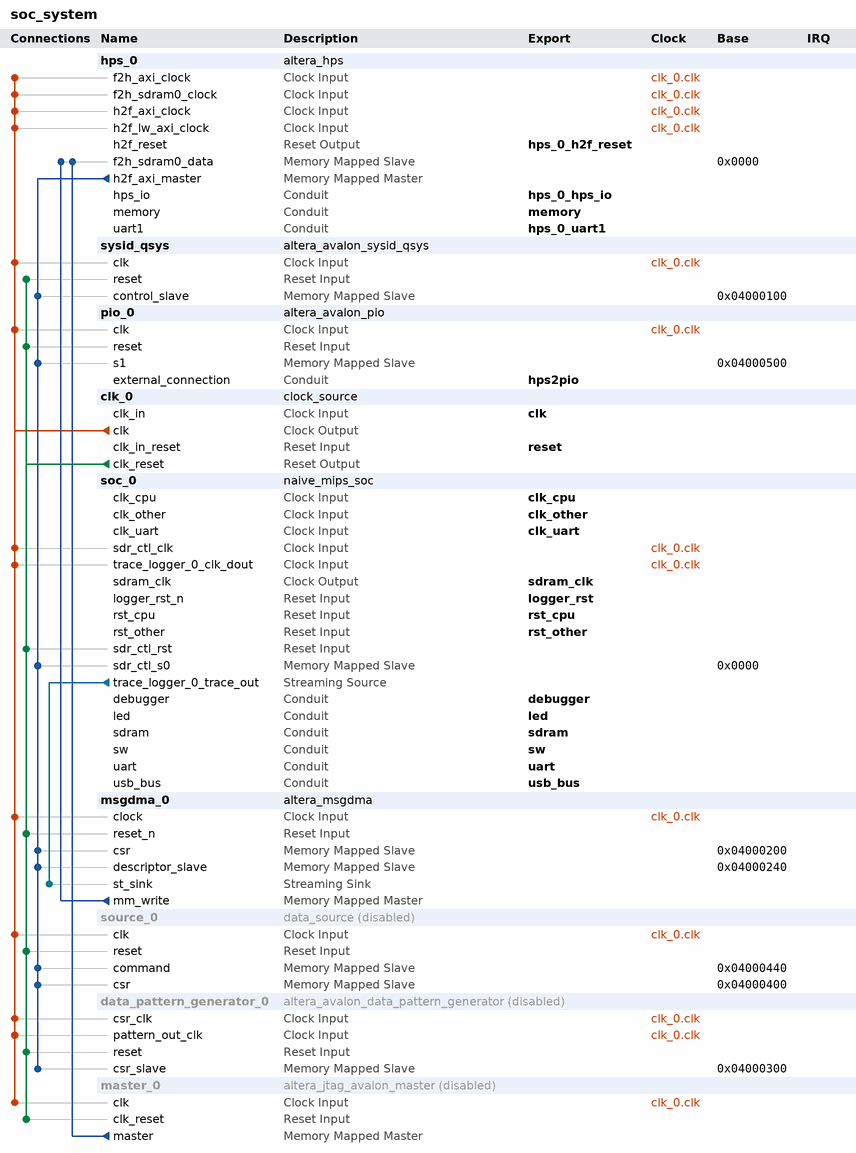
[diagram p0: system contents]
# Platform Designer (Qsys) system soc_system, Cyclone V 5CSEMA5F31C6
# Parameters at their usual value, and those the tool derives, are not listed.
package require -exact qsys 15.1
create_system soc_system
set_project_property DEVICE_FAMILY {Cyclone V}
set_project_property DEVICE 5CSEMA5F31C6

add_instance hps_0 altera_hps 15.1
set_instance_parameter_value hps_0 EMAC1_Mode RGMII
set_instance_parameter_value hps_0 EMAC1_PinMuxing {HPS I/O Set 0}
set_instance_parameter_value hps_0 F2SCLK_COLDRST_Enable false
set_instance_parameter_value hps_0 F2SCLK_DBGRST_Enable false
set_instance_parameter_value hps_0 F2SCLK_WARMRST_Enable false
set_instance_parameter_value hps_0 F2SDRAM_Type {Avalon-MM Bidirectional}
set_instance_parameter_value hps_0 F2SDRAM_Width 256
set_instance_parameter_value hps_0 F2SINTERRUPT_Enable false
set_instance_parameter_value hps_0 F2S_Width 2
set_instance_parameter_value hps_0 FPGA_PERIPHERAL_OUTPUT_CLOCK_FREQ_EMAC0_GTX_CLK 100
set_instance_parameter_value hps_0 FPGA_PERIPHERAL_OUTPUT_CLOCK_FREQ_EMAC0_MD_CLK 100.0
set_instance_parameter_value hps_0 FPGA_PERIPHERAL_OUTPUT_CLOCK_FREQ_EMAC1_GTX_CLK 100
set_instance_parameter_value hps_0 FPGA_PERIPHERAL_OUTPUT_CLOCK_FREQ_EMAC1_MD_CLK 100.0
set_instance_parameter_value hps_0 HPS_PROTOCOL DDR3
set_instance_parameter_value hps_0 I2C0_Mode I2C
set_instance_parameter_value hps_0 I2C0_PinMuxing {HPS I/O Set 0}
set_instance_parameter_value hps_0 I2C1_Mode I2C
set_instance_parameter_value hps_0 I2C1_PinMuxing {HPS I/O Set 0}
set_instance_parameter_value hps_0 LWH2F_Enable true
set_instance_parameter_value hps_0 MEM_BANKADDR_WIDTH 3
set_instance_parameter_value hps_0 MEM_CLK_FREQ 400.0
set_instance_parameter_value hps_0 MEM_COL_ADDR_WIDTH 10
set_instance_parameter_value hps_0 MEM_DQ_WIDTH 32
set_instance_parameter_value hps_0 MEM_DRV_STR RZQ/6
set_instance_parameter_value hps_0 MEM_ROW_ADDR_WIDTH 15
set_instance_parameter_value hps_0 MEM_RTT_NOM RZQ/6
set_instance_parameter_value hps_0 MEM_RTT_WR {Dynamic ODT off}
set_instance_parameter_value hps_0 MEM_TCL 7
set_instance_parameter_value hps_0 MEM_TFAW_NS 45.0
set_instance_parameter_value hps_0 MEM_TRAS_NS 36.0
set_instance_parameter_value hps_0 MEM_TRCD_NS 13.125
set_instance_parameter_value hps_0 MEM_TRFC_NS 300.0
set_instance_parameter_value hps_0 MEM_TRP_NS 13.125
set_instance_parameter_value hps_0 MEM_VENDOR Micron
set_instance_parameter_value hps_0 MEM_WTCL 7
set_instance_parameter_value hps_0 QSPI_Mode {1 SS}
set_instance_parameter_value hps_0 QSPI_PinMuxing {HPS I/O Set 0}
set_instance_parameter_value hps_0 REF_CLK_FREQ 25.0
set_instance_parameter_value hps_0 S2FCLK_USER2CLK 1
set_instance_parameter_value hps_0 S2F_Width 1
set_instance_parameter_value hps_0 SDIO_Mode {4-bit Data}
set_instance_parameter_value hps_0 SDIO_PinMuxing {HPS I/O Set 0}
set_instance_parameter_value hps_0 SPIM1_Mode {Single Slave Select}
set_instance_parameter_value hps_0 SPIM1_PinMuxing {HPS I/O Set 0}
set_instance_parameter_value hps_0 STM_Enable false
set_instance_parameter_value hps_0 TIMING_BOARD_AC_SKEW 0.02
set_instance_parameter_value hps_0 TIMING_BOARD_AC_TO_CK_SKEW 0.01
set_instance_parameter_value hps_0 TIMING_BOARD_DQ_TO_DQS_SKEW 0.05
set_instance_parameter_value hps_0 TIMING_BOARD_MAX_CK_DELAY 0.03
set_instance_parameter_value hps_0 TIMING_BOARD_MAX_DQS_DELAY 0.02
set_instance_parameter_value hps_0 TIMING_BOARD_SKEW_BETWEEN_DQS 0.06
set_instance_parameter_value hps_0 TIMING_BOARD_SKEW_CKDQS_DIMM_MAX 0.12
set_instance_parameter_value hps_0 TIMING_BOARD_SKEW_CKDQS_DIMM_MIN 0.06
set_instance_parameter_value hps_0 TIMING_BOARD_SKEW_WITHIN_DQS 0.01
set_instance_parameter_value hps_0 TIMING_TDH 65
set_instance_parameter_value hps_0 TIMING_TDQSCK 255
set_instance_parameter_value hps_0 TIMING_TDQSQ 125
set_instance_parameter_value hps_0 TIMING_TDS 30
set_instance_parameter_value hps_0 TIMING_TIH 140
set_instance_parameter_value hps_0 TIMING_TIS 190
set_instance_parameter_value hps_0 TIMING_TQSH 0.4
set_instance_parameter_value hps_0 UART0_Mode {No Flow Control}
set_instance_parameter_value hps_0 UART0_PinMuxing {HPS I/O Set 0}
set_instance_parameter_value hps_0 UART1_Mode Full
set_instance_parameter_value hps_0 UART1_PinMuxing FPGA
set_instance_parameter_value hps_0 USB1_Mode SDR
set_instance_parameter_value hps_0 USB1_PinMuxing {HPS I/O Set 0}
set_instance_parameter_value hps_0 desired_cfg_clk_mhz 100.0
set_instance_parameter_value hps_0 desired_qspi_clk_mhz 400.0
set_instance_parameter_value hps_0 use_default_mpu_clk false

add_instance sysid_qsys altera_avalon_sysid_qsys 15.1
set_instance_parameter_value sysid_qsys id -1395322110

add_instance pio_0 altera_avalon_pio 15.1
set_instance_parameter_value pio_0 direction Output
set_instance_parameter_value pio_0 width 8

add_instance clk_0 clock_source 15.1
set_instance_parameter_value clk_0 clockFrequency 50000000
set_instance_parameter_value clk_0 resetSynchronousEdges DEASSERT

add_instance soc_0 naive_mips_soc 1.0

add_instance msgdma_0 altera_msgdma 15.1
set_instance_parameter_value msgdma_0 BURST_ENABLE 1
set_instance_parameter_value msgdma_0 DATA_FIFO_DEPTH 128
set_instance_parameter_value msgdma_0 DATA_WIDTH 128
set_instance_parameter_value msgdma_0 DESCRIPTOR_FIFO_DEPTH 8
set_instance_parameter_value msgdma_0 ENHANCED_FEATURES 0
set_instance_parameter_value msgdma_0 ERROR_ENABLE 0
set_instance_parameter_value msgdma_0 MAX_BURST_COUNT 32
set_instance_parameter_value msgdma_0 MAX_BYTE 1073741824
set_instance_parameter_value msgdma_0 MODE 2
set_instance_parameter_value msgdma_0 PACKET_ENABLE 0
set_instance_parameter_value msgdma_0 TRANSFER_TYPE {Aligned Accesses}

add_instance source_0 data_source 15.1
set_instance_property source_0 ENABLED false
set_instance_parameter_value source_0 dataOutBitsPerSymbol 8
set_instance_parameter_value source_0 dataOutErrorWidth 0
set_instance_parameter_value source_0 dataOutSymbolsPerBeat 16
set_instance_parameter_value source_0 dataOutUsePackets false
set_instance_parameter_value source_0 generationLanguage VERILOG
set_instance_parameter_value source_0 numberOfChannels 0
set_instance_parameter_value source_0 readyLatency 0
set_instance_parameter_value source_0 throttlePrbsSeed 1
set_instance_parameter_value source_0 useEmpty AUTO
set_instance_parameter_value source_0 useOptionalEmpty false
set_instance_parameter_value source_0 useReady true
set_instance_parameter_value source_0 useValid true

add_instance data_pattern_generator_0 altera_avalon_data_pattern_generator 15.1
set_instance_property data_pattern_generator_0 ENABLED false
set_instance_parameter_value data_pattern_generator_0 AVALON_ENABLED true
set_instance_parameter_value data_pattern_generator_0 BYPASS_ENABLED false
set_instance_parameter_value data_pattern_generator_0 CROSS_CLK_SYNC_DEPTH 2
set_instance_parameter_value data_pattern_generator_0 FREQ_CNTER_ENABLED false
set_instance_parameter_value data_pattern_generator_0 ST_DATA_W 128

add_instance master_0 altera_jtag_avalon_master 15.1
set_instance_property master_0 ENABLED false

# connections
add_connection clk_0.clk data_pattern_generator_0.csr_clk clock
add_connection clk_0.clk data_pattern_generator_0.pattern_out_clk clock
add_connection clk_0.clk hps_0.f2h_axi_clock clock
add_connection clk_0.clk hps_0.f2h_sdram0_clock clock
add_connection clk_0.clk hps_0.h2f_axi_clock clock
add_connection clk_0.clk hps_0.h2f_lw_axi_clock clock
add_connection clk_0.clk master_0.clk clock
add_connection clk_0.clk msgdma_0.clock clock
add_connection clk_0.clk pio_0.clk clock
add_connection clk_0.clk soc_0.sdr_ctl_clk clock
add_connection clk_0.clk soc_0.trace_logger_0_clk_dout clock
add_connection clk_0.clk source_0.clk clock
add_connection clk_0.clk sysid_qsys.clk clock
add_connection clk_0.clk_reset data_pattern_generator_0.reset reset
add_connection clk_0.clk_reset master_0.clk_reset reset
add_connection clk_0.clk_reset msgdma_0.reset_n reset
add_connection clk_0.clk_reset pio_0.reset reset
add_connection clk_0.clk_reset soc_0.sdr_ctl_rst reset
add_connection clk_0.clk_reset source_0.reset reset
add_connection clk_0.clk_reset sysid_qsys.reset reset
add_connection hps_0.h2f_axi_master data_pattern_generator_0.csr_slave avalon
set_connection_parameter_value hps_0.h2f_axi_master/data_pattern_generator_0.csr_slave baseAddress 0x04000300
add_connection hps_0.h2f_axi_master msgdma_0.csr avalon
set_connection_parameter_value hps_0.h2f_axi_master/msgdma_0.csr baseAddress 0x04000200
add_connection hps_0.h2f_axi_master msgdma_0.descriptor_slave avalon
set_connection_parameter_value hps_0.h2f_axi_master/msgdma_0.descriptor_slave baseAddress 0x04000240
add_connection hps_0.h2f_axi_master pio_0.s1 avalon
set_connection_parameter_value hps_0.h2f_axi_master/pio_0.s1 baseAddress 0x04000500
add_connection hps_0.h2f_axi_master soc_0.sdr_ctl_s0 avalon
set_connection_parameter_value hps_0.h2f_axi_master/soc_0.sdr_ctl_s0 baseAddress 0x0000
add_connection hps_0.h2f_axi_master source_0.command avalon
set_connection_parameter_value hps_0.h2f_axi_master/source_0.command baseAddress 0x04000440
add_connection hps_0.h2f_axi_master source_0.csr avalon
set_connection_parameter_value hps_0.h2f_axi_master/source_0.csr baseAddress 0x04000400
add_connection hps_0.h2f_axi_master sysid_qsys.control_slave avalon
set_connection_parameter_value hps_0.h2f_axi_master/sysid_qsys.control_slave baseAddress 0x04000100
add_connection master_0.master hps_0.f2h_sdram0_data avalon
set_connection_parameter_value master_0.master/hps_0.f2h_sdram0_data baseAddress 0x0000
add_connection msgdma_0.mm_write hps_0.f2h_sdram0_data avalon
set_connection_parameter_value msgdma_0.mm_write/hps_0.f2h_sdram0_data baseAddress 0x0000
add_connection soc_0.trace_logger_0_trace_out msgdma_0.st_sink avalon_streaming

# exported interfaces
add_interface clk clock sink
set_interface_property clk EXPORT_OF clk_0.clk_in
add_interface clk_cpu clock sink
set_interface_property clk_cpu EXPORT_OF soc_0.clk_cpu
add_interface clk_other clock sink
set_interface_property clk_other EXPORT_OF soc_0.clk_other
add_interface clk_uart clock sink
set_interface_property clk_uart EXPORT_OF soc_0.clk_uart
add_interface debugger conduit end
set_interface_property debugger EXPORT_OF soc_0.debugger
add_interface hps2pio conduit end
set_interface_property hps2pio EXPORT_OF pio_0.external_connection
add_interface hps_0_h2f_reset reset source
set_interface_property hps_0_h2f_reset EXPORT_OF hps_0.h2f_reset
add_interface hps_0_hps_io conduit end
set_interface_property hps_0_hps_io EXPORT_OF hps_0.hps_io
add_interface hps_0_uart1 conduit end
set_interface_property hps_0_uart1 EXPORT_OF hps_0.uart1
add_interface led conduit end
set_interface_property led EXPORT_OF soc_0.led
add_interface logger_rst reset sink
set_interface_property logger_rst EXPORT_OF soc_0.logger_rst_n
add_interface memory conduit end
set_interface_property memory EXPORT_OF hps_0.memory
add_interface reset reset sink
set_interface_property reset EXPORT_OF clk_0.clk_in_reset
add_interface rst_cpu reset sink
set_interface_property rst_cpu EXPORT_OF soc_0.rst_cpu
add_interface rst_other reset sink
set_interface_property rst_other EXPORT_OF soc_0.rst_other
add_interface sdram conduit end
set_interface_property sdram EXPORT_OF soc_0.sdram
add_interface sdram_clk clock source
set_interface_property sdram_clk EXPORT_OF soc_0.sdram_clk
add_interface sw conduit end
set_interface_property sw EXPORT_OF soc_0.sw
add_interface uart conduit end
set_interface_property uart EXPORT_OF soc_0.uart
add_interface usb_bus conduit end
set_interface_property usb_bus EXPORT_OF soc_0.usb_bus

set_interconnect_requirement {$system} qsys_mm.clockCrossingAdapter HANDSHAKE
set_interconnect_requirement {$system} qsys_mm.maxAdditionalLatency 1

save_system soc_system.qsys
